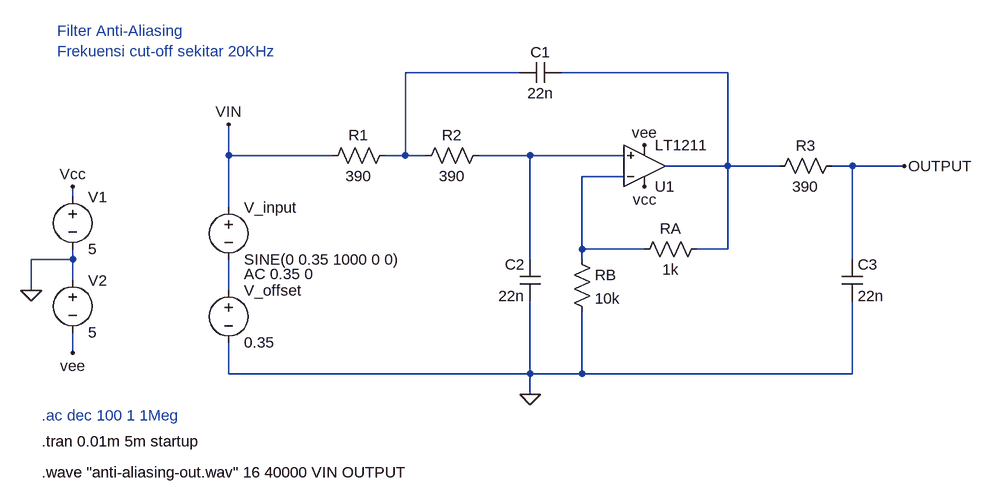
[diagram p0: schematic anti-aliasing-filter.asc]
anti-aliasing-filter.asc, the LTspice schematic file:
Version 4
SHEET 1 884 680
WIRE 192 -144 16 -144
WIRE 512 -144 256 -144
WIRE -256 -16 -256 -64
WIRE -96 -16 -256 -16
WIRE 16 -16 16 -144
WIRE 16 -16 -16 -16
WIRE 48 -16 16 -16
WIRE 208 -16 128 -16
WIRE 352 -16 208 -16
WIRE 512 0 512 -144
WIRE 512 0 416 0
WIRE 592 0 512 0
WIRE 704 0 672 0
WIRE 784 0 704 0
WIRE 352 16 288 16
WIRE -496 48 -496 32
WIRE -256 64 -256 -16
WIRE 288 128 288 16
WIRE 384 128 288 128
WIRE 512 128 512 0
WIRE 512 128 464 128
WIRE -496 144 -496 128
WIRE -496 144 -560 144
WIRE 208 144 208 -16
WIRE 288 144 288 128
WIRE 704 144 704 0
WIRE -496 176 -496 144
WIRE -560 192 -560 144
WIRE -256 192 -256 144
WIRE -496 288 -496 256
WIRE -256 320 -256 272
WIRE 208 320 208 208
WIRE 208 320 -256 320
WIRE 288 320 288 224
WIRE 288 320 208 320
WIRE 704 320 704 208
WIRE 704 320 288 320
WIRE 208 352 208 320
FLAG -496 32 Vcc
FLAG 384 32 vcc
FLAG -496 288 vee
FLAG 384 -32 vee
FLAG -560 192 0
FLAG 208 352 0
FLAG 784 0 OUTPUT
FLAG -256 -64 VIN
SYMBOL voltage -256 48 R0
WINDOW 123 24 118 Left 2
WINDOW 39 0 0 Left 0
SYMATTR Value2 AC 0.35 0
SYMATTR InstName V_input
SYMATTR Value SINE(0 0.35 1000 0 0)
SYMBOL voltage -256 176 R0
WINDOW 123 0 0 Left 0
WINDOW 39 0 0 Left 0
SYMATTR InstName V_offset
SYMATTR Value 0.35
SYMBOL res 0 -32 R90
WINDOW 0 0 56 VBottom 2
WINDOW 3 32 56 VTop 2
SYMATTR InstName R1
SYMATTR Value 390
SYMBOL res 144 -32 R90
WINDOW 0 0 56 VBottom 2
WINDOW 3 32 56 VTop 2
SYMATTR InstName R2
SYMATTR Value 390
SYMBOL Opamps/LT1211 384 64 M180
SYMATTR InstName U1
SYMBOL cap 256 -160 R90
WINDOW 0 0 32 VBottom 2
WINDOW 3 32 32 VTop 2
SYMATTR InstName C1
SYMATTR Value 22n
SYMBOL cap 224 208 R180
WINDOW 0 24 56 Left 2
WINDOW 3 24 8 Left 2
SYMATTR InstName C2
SYMATTR Value 22n
SYMBOL res 272 128 R0
SYMATTR InstName RB
SYMATTR Value 10k
SYMBOL res 480 112 R90
WINDOW 0 0 56 VBottom 2
WINDOW 3 32 56 VTop 2
SYMATTR InstName RA
SYMATTR Value 1k
SYMBOL voltage -496 32 R0
SYMATTR InstName V1
SYMATTR Value 5
SYMBOL voltage -496 160 R0
SYMATTR InstName V2
SYMATTR Value 5
SYMBOL res 688 -16 R90
WINDOW 0 0 56 VBottom 2
WINDOW 3 32 56 VTop 2
SYMATTR InstName R3
SYMATTR Value 390
SYMBOL cap 688 144 R0
SYMATTR InstName C3
SYMATTR Value 22n
TEXT -544 424 Left 2 !.tran 0.01m 5m startup
TEXT -544 472 Left 2 !.wave "anti-aliasing-out.wav" 16 40000 VIN OUTPUT
TEXT -544 384 Left 2 ;.ac dec 100 1 1Meg
TEXT -520 -208 Left 2 ;Filter Anti-Aliasing\nFrekuensi cut-off sekitar 20KHz

The netlist it stands for:
* anti-aliasing-filter.asc
V_input VIN N005 SINE(0 0.35 1000 0 0) AC 0.35 0
V_offset N005 0 0.35
R1 N001 VIN 390
R2 N003 N001 390
XU1 N003 N004 Vcc vee N002 LT1211  ; pins In+ In- V+ V- OUT
C1 N002 N001 22n
C2 0 N003 22n
RB N004 0 10k
RA N002 N004 1k
V1 Vcc 0 5
V2 0 vee 5
R3 OUTPUT N002 390
C3 OUTPUT 0 22n
.tran 0.01m 5m startup
.wave "anti-aliasing-out.wav" 16 40000 VIN OUTPUT
* .ac dec 100 1 1Meg
* Filter Anti-Aliasing
* Frekuensi cut-off sekitar 20KHz
.lib LTC.lib
.backanno
.end